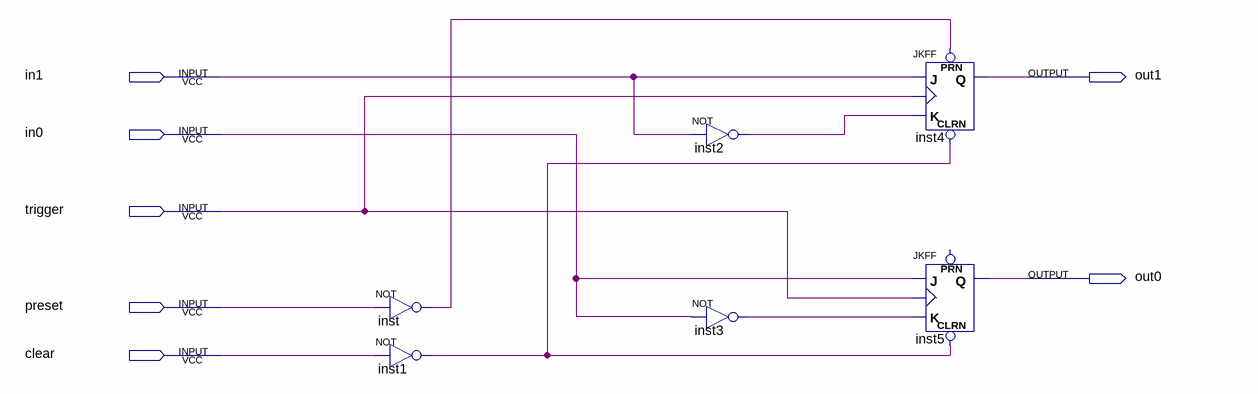
[diagram p0: schematic sheet]
// Quartus schematic reg2.bdf as structural Verilog: 6 symbols, 7 pins
module reg2 (
  input  in1,
  input  in0,
  input  trigger,
  input  preset,
  input  clear,
  output out1,
  output out0
);

  wire inst1_out, inst2_out, inst3_out, inst_out;

  not inst (inst_out, preset);
  not inst1 (inst1_out, clear);
  not inst2 (inst2_out, in1);
  not inst3 (inst3_out, in0);
  JKFF inst4 (.PRN(inst_out), .CLRN(inst1_out), .K(inst2_out), .J(in1), .CLK(trigger), .Q(out1));
  JKFF inst5 (.CLRN(inst1_out), .K(inst3_out), .J(in0), .CLK(trigger), .Q(out0));  // open: PRN
endmodule
